# Altium project BRTPOT.PrjPcb
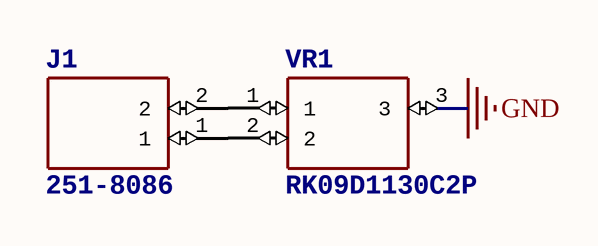
[diagram p0: BRTPOT_SHEET.SchDoc]
1 sheet, 2 parts. Net scope: global (net labels, ports and power ports of the same name join across sheets).

## Sheet BRTPOT_SHEET.SchDoc: Brightness Potentiometer Board Sheet
size A4; Revision: 1.0.0; SheetNumber: 3; SheetTotal: 3; ProjectName: TheTomcatProject

### Parts
J1  251-8086  [2518086]
VR1  RK09D1130C2P  [RK09D1130C3C]

### Nets
GND: VR1.3
NetJ1_1: J1.1 VR1.2
NetJ1_2: J1.2 VR1.1

### Notes on the sheet
- Title
- Size:
- Date:
- A4
- Number:
- Time:
- Revision:
- Sheet
- of
- File:

### Library data of the parts
J1 = 251-8086: Manufacturer_Name: RS Components; Manufacturer_Part_Number: 251-8086; Height: 9.4mm
VR1 = RK09D1130C2P: Manufacturer_Name: ALPS Electric; Manufacturer_Part_Number: RK09D1130C2P; Mouser_Part_Number: 688-RK09D1130C2P; Mouser_Price-Stock: https://www.mouser.co.uk/ProductDetail/ALPS/RK09D1130C2P?qs=seHrhfPpLDw%2FxdY1Q%252B3DvA%3D%3D; Arrow_Part_Number: RK09D1130C2P; Arrow_Price-Stock: https://www.arrow.com/en/products/rk09d1130c2p/alps-electric; Height: mm